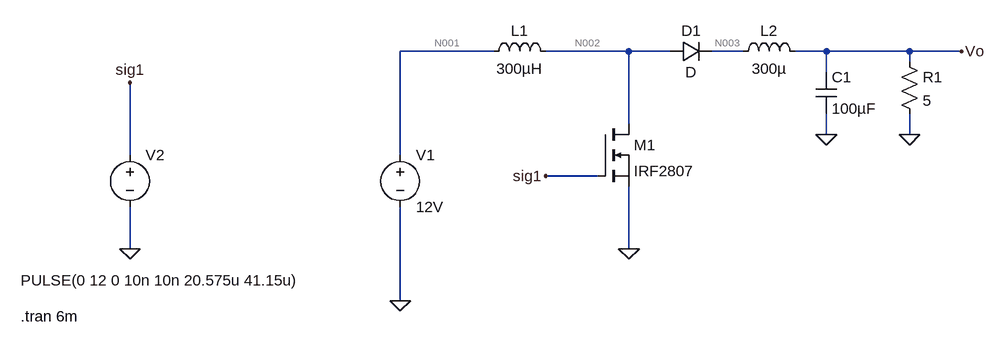
[diagram p0: schematic boost_ltSpice.asc]
boost_ltSpice.asc, the LTspice schematic file:
Version 4
SHEET 1 880 680
WIRE 32 -16 -112 -16
WIRE 240 -16 112 -16
WIRE 304 -16 240 -16
WIRE 416 -16 368 -16
WIRE 544 -16 496 -16
WIRE 672 -16 544 -16
WIRE 752 -16 672 -16
WIRE 672 0 672 -16
WIRE 544 16 544 -16
WIRE 240 96 240 -16
WIRE 544 112 544 80
WIRE 672 112 672 80
WIRE -528 144 -528 32
WIRE -112 144 -112 -16
WIRE 192 176 112 176
WIRE -528 288 -528 224
WIRE 240 288 240 192
WIRE -112 368 -112 224
FLAG 240 288 0
FLAG -112 368 0
FLAG -528 288 0
FLAG 112 176 sig1
FLAG -528 32 sig1
FLAG 544 112 0
FLAG 672 112 0
FLAG 752 -16 Vo
SYMBOL nmos 192 96 R0
SYMATTR InstName M1
SYMATTR Value IRF2807
SYMBOL voltage -112 128 R0
WINDOW 123 0 0 Left 2
WINDOW 39 0 0 Left 2
SYMATTR InstName V1
SYMATTR Value 12V
SYMBOL voltage -528 128 R0
WINDOW 3 -168 209 Left 2
WINDOW 123 0 0 Left 2
WINDOW 39 0 0 Left 2
SYMATTR Value PULSE(0 12 0 10n 10n 20.575u 41.15u)
SYMATTR InstName V2
SYMBOL ind 16 0 R270
WINDOW 0 32 56 VTop 2
WINDOW 3 5 56 VBottom 2
SYMATTR InstName L1
SYMATTR Value 300µH
SYMBOL cap 528 16 R0
SYMATTR InstName C1
SYMATTR Value 100µF
SYMBOL res 656 -16 R0
SYMATTR InstName R1
SYMATTR Value 5
SYMBOL diode 304 0 R270
WINDOW 0 32 32 VTop 2
WINDOW 3 0 32 VBottom 2
SYMATTR InstName D1
SYMBOL ind 400 0 R270
WINDOW 0 32 56 VTop 2
WINDOW 3 5 56 VBottom 2
SYMATTR InstName L2
SYMATTR Value 300µ
TEXT -696 392 Left 2 !.tran 6m

The netlist it stands for:
* boost_ltSpice.asc
M1 N002 sig1 0 0 IRF2807
V1 N001 0 12V
V2 sig1 0 PULSE(0 12 0 10n 10n 20.575u 41.15u)
L1 N001 N002 300µH
C1 Vo 0 100µF
R1 Vo 0 5
D1 N002 N003 D
L2 N003 Vo 300µ
.model D D
.lib standard.dio
.model NMOS NMOS
.model PMOS PMOS
.lib standard.mos
.tran 6m
.backanno
.end

* Results of the author's LTspice run, read from the files saved beside the schematic
* Operating Point, zero values left out:
*   V(n002) = 12 V
*   V(n001) = 12 V
*   V(vo) = 11.14 V
*   V(n003) = 11.14 V
*   Id(M1) = 16.4 pA
*   Is(M1) = -16.4 pA
*   I(D1) = 2.228 A
*   I(L2) = 2.228 A
*   I(L1) = 2.228 A
*   I(R1) = 2.228 A
*   I(V1) = -2.228 A
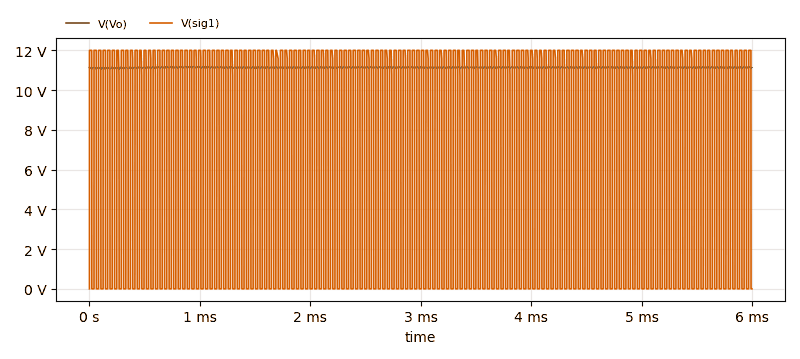
[diagram p1: Transient Analysis of boost_ltSpice.asc, plotted from the saved traces]
* Transient Analysis, 1 run:
*   V(Vo): min 11.05 V, max 11.19 V, average 11.14 V, rms 11.14 V, last 11.16 V
*   V(sig1): min 0 V, max 12 V, average 6.011 V, rms 8.492 V, last 0 V